# Altium schematic sheet Power_management.SchDoc: Power
size A3; SheetNumber: 3
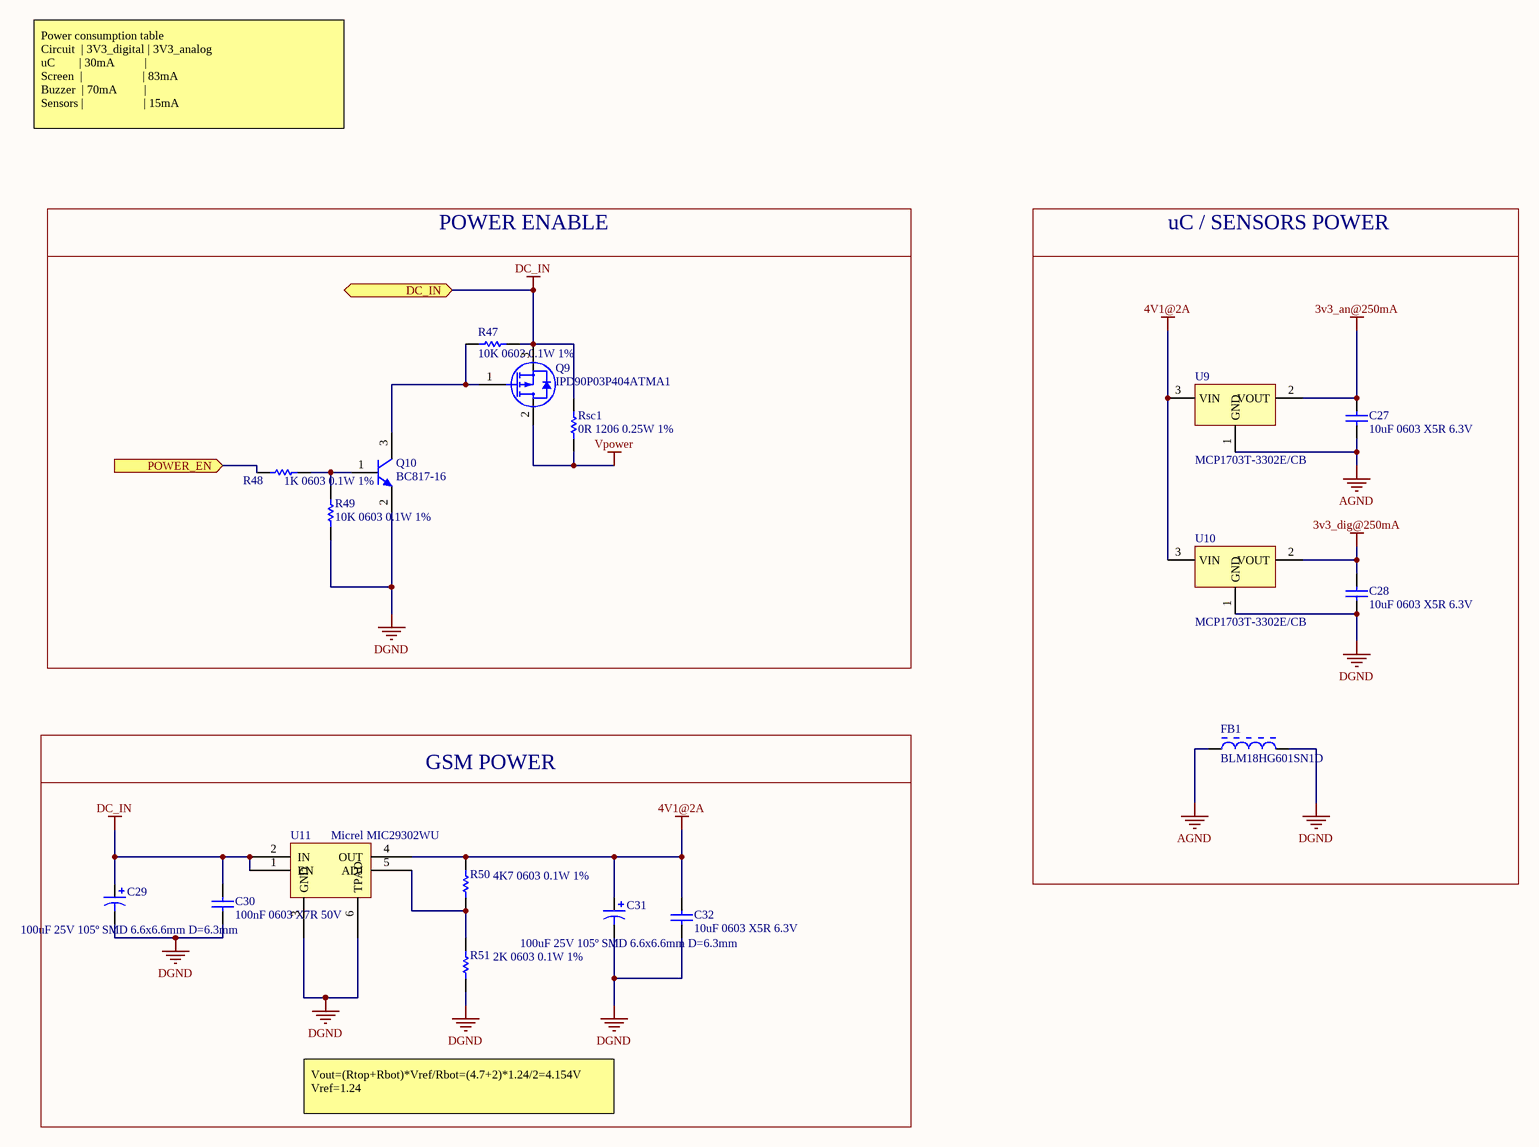
[diagram p0: Power_management.SchDoc]

## Parts
C27  10uF 0603 X5R 6.3V  [CAPC1608X60X35NL10T15]
C28  10uF 0603 X5R 6.3V  [CAPC1608X60X35NL10T15]
C29  100uF 25V 105º SMD 6.6x6.6mm D=6.3mm  [PCB-5eg0a5nygcrzw5ibm1j9-1]
C30  100nF 0603 X7R 50V  [CAPC1608X60X35NL10T15]
C31  100uF 25V 105º SMD 6.6x6.6mm D=6.3mm  [PCB-5eg0a5nygcrzw5ibm1j9-1]
C32  10uF 0603 X5R 6.3V  [CAPC1608X60X35NL10T15]
FB1  BLM18HG601SN1D  [MURA-BLM18-F-H1-CHIP-2_V]
Q9  IPD90P03P404ATMA1  [DPAK IPD90P03P404ATMA1]
Q10  BC817-16  [PCB-856332-1]
R47  10K 0603 0.1W 1%  [RESC1609X55X30ML10T20]
R48  1K 0603 0.1W 1%  [RESC1609X55X30ML10T20]
R49  10K 0603 0.1W 1%  [RESC1609X55X30ML10T20]
R50  4K7 0603 0.1W 1%  [RESC1609X55X30ML10T20]
R51  2K 0603 0.1W 1%  [RESC1609X55X30ML10T20]
Rsc1  0R 1206 0.25W 1%  [PCB-sxvxwfnl72ysl1kmtzgv-1]  (no BOM)
U9  MCP1703T-3302E/CB  [SOT-23A-CB3_L]
U10  MCP1703T-3302E/CB  [SOT-23A-CB3_L]
U11  Micrel MIC29302WU  [TI-KTT5_N]

## Blocks framed on the sheet
POWER ENABLE: Q9 Q10 R47-R49 Rsc1
uC / SENSORS POWER: C27 C28 FB1 U9 U10
GSM POWER: C29-C32 R50 R51 U11

## Ports
DC_IN, POWER_EN (in)

## Nets
3v3_an@250mA: C27.2 U9.2(VOUT)
3v3_dig@250mA: C28.2 U10.2(VOUT)
4V1@2A: C31.1 C32.2 R50.2 U9.3(VIN) U10.3(VIN) U11.4(OUT)
AGND: C27.1 FB1.1 U9.1(GND)
DC_IN: C29.1 C30.2 Q9.3(S) R47.2 Rsc1.2 U11.1(EN) U11.2(IN) ; port DC_IN
DGND: C28.1 C29.2 C30.1 C31.2 C32.1 FB1.2 Q10.2(E) R49.2 R51.1 U10.1(GND) U11.3(GND) U11.6(TPAD)
Vpower: Q9.2(D) Rsc1.1
POWER_EN: R48.1 ; port POWER_EN
NetQ9_1: Q9.1(G) Q10.3(C) R47.1
NetQ10_1: Q10.1(B) R48.2 R49.1
NetR50_1: R50.1 R51.2 U11.5(ADJ)

## Notes on the sheet
- Power consumption table
  Circuit  | 3V3_digital | 3V3_analog
  uC        | 30mA          |
  Screen  |                    | 83mA
  Buzzer  | 70mA         |
  Sensors |                    | 15mA
- Vout=(Rtop+Rbot)*Vref/Rbot=(4.7+2)*1.24/2=4.154V
  Vref=1.24
- Title
- Size:
- Date:
- A3
- Author:
- Time:
- Revision:
- Sheet
- of
- File:

## Library data of the parts
C27 C28 C32 = CMP-121364-8: Rated voltage: 6v3; Dielectric carachteristic: X5R; Capacitance: 10uF; package: 0603
C29 C31 = CMP-a6d16ad512617916-1: Manufacturer Part Number: VZL101M1ETR-0607; Tolerance: 20%; Octopart URL: https://octopart.com/vzl101m1etr-0607-lelon-84840918; OctopartID: a6d16ad512617916; Capacity: 100uF; Voltage rating: 25V
C30 = CMP-c41a0d2b65641bdd-3: 100nF 0603 X7R 25V; package: 0603; capacitance: 100 nF; Dielectric Characteristic: X7R; Rated voltage: 25V
FB1 = CMP-19299602-3: Current Rating: 0.2 A; Frequency: 100000000.0 Hz; Lead-Free Status: Lead Free; Number of Circuits: 1; Resistance: 600.0 Ω; Shielding: No; Value: 600ohm 200mA; Manufacturer Part Number: BLM18HG601SN1D; Case/Package: 0603; Mounting Style: Surface Mount; Number of Pins: 2; Octopart Url: https://octopart.com/blm18hg601sn1d-murata-368340; OctopartID: c121082e7a931ee6; REACH SVHC Compliance: No SVHC; RoHS: Compliant; Size-Height: 0.0008 m; Size-Length: 0.0016 m; Size-Width: 0.0008 m
Q9 = CMP-3103264-6: Single P-Channel 30 V 4.5 mOhm 100 nC OptiMOS Power Mosfet - TO-252-3-11; Lead-Free Status: Lead Free; REACH SVHC Compliance: No SVHC; Octopart URL: https://octopart.com/ipd90p03p404atma1-infineon-21386769; Polarity: P-Channel; RoHS: Compliant; Mounting Style: Surface Mount; Operating Temperature: 175 °C (max); Packaging: Reel; Number of Pins: 3; OctopartID: f6ad3ee185da296a; Manufacturer Part Number: IPD90P03P404ATMA1; Manufacturer Part Number 2: WSF70P03
Q10 = CMP-856332-3: TRANS NPN 45V 500mA SMD SOT23-3; Current Rating: 0.6 A; Lead-Free Status: Lead Free; Power Dissipation: 0.3 W; Voltage Rating (DC): 40.0 V; Case/Package: SOT-23; Lifecycle Status: Active; Mounting Style: Surface Mount; Number of Pins: 3; Octopart Url: https://octopart.com/mmbt2222a-7-f-diodes+inc.-357838; OctopartID: 53a79aa8030f8c60; Packaging: Cut Tape (CT); Polarity: NPN; REACH SVHC Compliance: No SVHC; RoHS: Compliant
R47 R49 = CMP-4716590-9: Octopart Url: https://octopart.com/crcw060310k0fkeahp-vishay-42634028; package: 0603; Resistance: 10k; Tolerance: 1%
  R47: DNP: DNP
R48 = CMP-a61f6f36030f79d8-4: Manufacturer Part Number: CR0603-FX-1001ELF; Power Rating: 100 mW; Case/Package (SI): 1608; Voltage Rating (DC): 50.0 V; Temperature Coefficient: -100 ppm/°C to 100 ppm/°C; REACH SVHC Compliance: No SVHC; Packaging: Tape & Reel (TR), Cut Tape (CT); Resistance Tolerance: ±1%; Resistance: 1k; RoHS: Compliant; Mounting Style: Surface Mount; Number of Pins: 2; Size-Length: 1.60 mm; Octopart URL: https://octopart.com/cr0603-fx-1001elf-bourns-2326646; Size-Thickness: 457 µm; OctopartID: a61f6f36030f79d8; Size-Width: 787 µm; Case/Package: 0603
R50 R51 = CMP-3655986-6: Tolerance: 1%; package: 0603
  R50: Resistance: 4K7
  R51: Resistance: 2K
Rsc1 = CMP-3f1bf473a47ce0dc-5: Manufacturer Part Number: RC1206JR-070RL; Lead-Free Status: Lead Free; Resistance Tolerance: ±5%; Voltage Rating (DC): 200 V; Power Rating: 250 mW; Case/Package (SI): 3216; Resistance: 0R; Packaging: Cut Tape (CT), Tape & Reel (TR); Size-Width: 1.60 mm; Case/Package: 1206; Mounting Style: Surface Mount; Size-Length: 3.10 mm; OctopartID: 3f1bf473a47ce0dc; Number of Pins: 2; RoHS: Compliant
U9 U10 = CMP-1493313-4: Lead-Free Status: Lead Free; Number of Outputs: 1; Output Capacitor Type: Ceramic; Quiescent Current: 2e-06 A; Dropout Voltage: 0.65 V; RoHS: Compliant; Mounting Style: Surface Mount; OctopartID: 3caef5ca6a72e369; Packaging: Cut Tape (CT); Octopart Url: https://octopart.com/mcp1703t-3302e%2Fcb-microchip-7238586; Lifecycle Status: Active; Number of Pins: 3; REACH SVHC Compliance: No SVHC; Manufacturer Part Number: MCP1703T-3302E/CB
U11 = CMP-703eb93c7bacaff9-6: MIC29302 Series 3 A 1.24 to 26 V ADJ Output Voltage LDO Regulator - TO-263-5